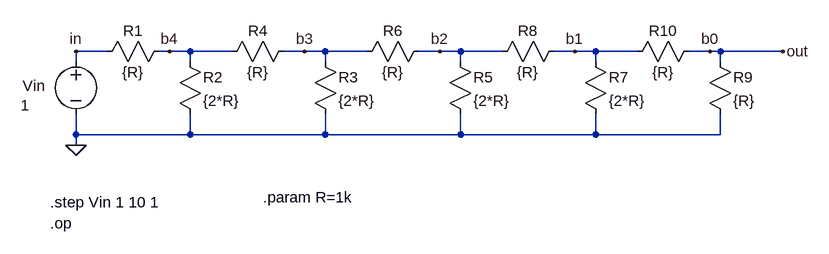
[diagram p0: schematic DC op point - STEP.asc]
DC op point - STEP.asc, the LTspice schematic file:
Version 4
SHEET 1 1240 680
WIRE 144 224 96 224
WIRE 240 224 224 224
WIRE 272 224 240 224
WIRE 336 224 272 224
WIRE 448 224 416 224
WIRE 480 224 448 224
WIRE 544 224 480 224
WIRE 656 224 624 224
WIRE 688 224 656 224
WIRE 752 224 688 224
WIRE 864 224 832 224
WIRE 896 224 864 224
WIRE 960 224 896 224
WIRE 1072 224 1040 224
WIRE 1088 224 1072 224
WIRE 1184 224 1088 224
WIRE 96 240 96 224
WIRE 272 240 272 224
WIRE 480 240 480 224
WIRE 688 240 688 224
WIRE 896 240 896 224
WIRE 1088 240 1088 224
WIRE 96 352 96 320
WIRE 272 352 272 320
WIRE 272 352 96 352
WIRE 480 352 480 320
WIRE 480 352 272 352
WIRE 688 352 688 320
WIRE 688 352 480 352
WIRE 896 352 896 320
WIRE 896 352 688 352
WIRE 1088 352 1088 320
WIRE 1088 352 896 352
WIRE 96 368 96 352
FLAG 96 368 0
FLAG 96 224 in
FLAG 1072 224 b0
FLAG 864 224 b1
FLAG 656 224 b2
FLAG 448 224 b3
FLAG 240 224 b4
FLAG 1184 224 out
SYMBOL voltage 96 224 R0
WINDOW 123 0 0 Left 0
WINDOW 39 0 0 Left 0
WINDOW 0 -82 53 Left 2
WINDOW 3 -85 83 Left 2
SYMATTR InstName Vin
SYMATTR Value 1
SYMBOL res 240 208 R90
WINDOW 0 0 56 VBottom 2
WINDOW 3 32 56 VTop 2
SYMATTR InstName R1
SYMATTR Value {R}
SYMBOL res 256 224 R0
SYMATTR InstName R2
SYMATTR Value {2*R}
SYMBOL res 464 224 R0
SYMATTR InstName R3
SYMATTR Value {2*R}
SYMBOL res 432 208 R90
WINDOW 0 0 56 VBottom 2
WINDOW 3 32 56 VTop 2
SYMATTR InstName R4
SYMATTR Value {R}
SYMBOL res 672 224 R0
SYMATTR InstName R5
SYMATTR Value {2*R}
SYMBOL res 640 208 R90
WINDOW 0 0 56 VBottom 2
WINDOW 3 32 56 VTop 2
SYMATTR InstName R6
SYMATTR Value {R}
SYMBOL res 880 224 R0
SYMATTR InstName R7
SYMATTR Value {2*R}
SYMBOL res 848 208 R90
WINDOW 0 0 56 VBottom 2
WINDOW 3 32 56 VTop 2
SYMATTR InstName R8
SYMATTR Value {R}
SYMBOL res 1072 224 R0
SYMATTR InstName R9
SYMATTR Value {R}
SYMBOL res 1056 208 R90
WINDOW 0 0 56 VBottom 2
WINDOW 3 32 56 VTop 2
SYMATTR InstName R10
SYMATTR Value {R}
TEXT 56 488 Left 2 !.op
TEXT 56 456 Left 2 !.step Vin 1 10 1
TEXT 384 448 Left 2 !.param R=1k

The netlist it stands for:
* DC op point - STEP.asc
Vin in 0 1
R1 b4 in {R}
R2 b4 0 {2*R}
R3 b3 0 {2*R}
R4 b3 b4 {R}
R5 b2 0 {2*R}
R6 b2 b3 {R}
R7 b1 0 {2*R}
R8 b1 b2 {R}
R9 out 0 {R}
R10 out b1 {R}
.op
.step Vin 1 10 1
.param R=1k
.backanno
.end

* Results of the author's LTspice run, read from the files saved beside the schematic
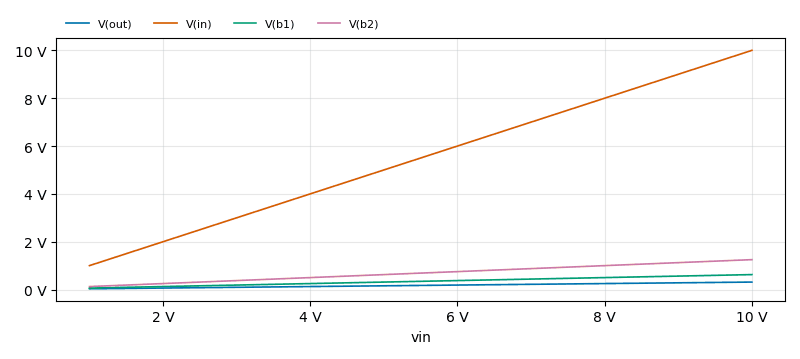
[diagram p1: Operating Point of DC op point - STEP.asc, plotted from the saved traces]
* Operating Point, 1 run:
*   V(out): 31.25 mV at vin=1 V, 312.5 mV at vin=10 V, min 31.25 mV, max 312.5 mV
*   V(in): 1 V at vin=1 V, 10 V at vin=10 V, min 1 V, max 10 V
*   V(b1): 62.5 mV at vin=1 V, 625 mV at vin=10 V, min 62.5 mV, max 625 mV
*   V(b2): 125 mV at vin=1 V, 1.25 V at vin=10 V, min 125 mV, max 1.25 V